# EAGLE schematic NitroxAnalyzer_v2 (EAGLE 7.3.0)
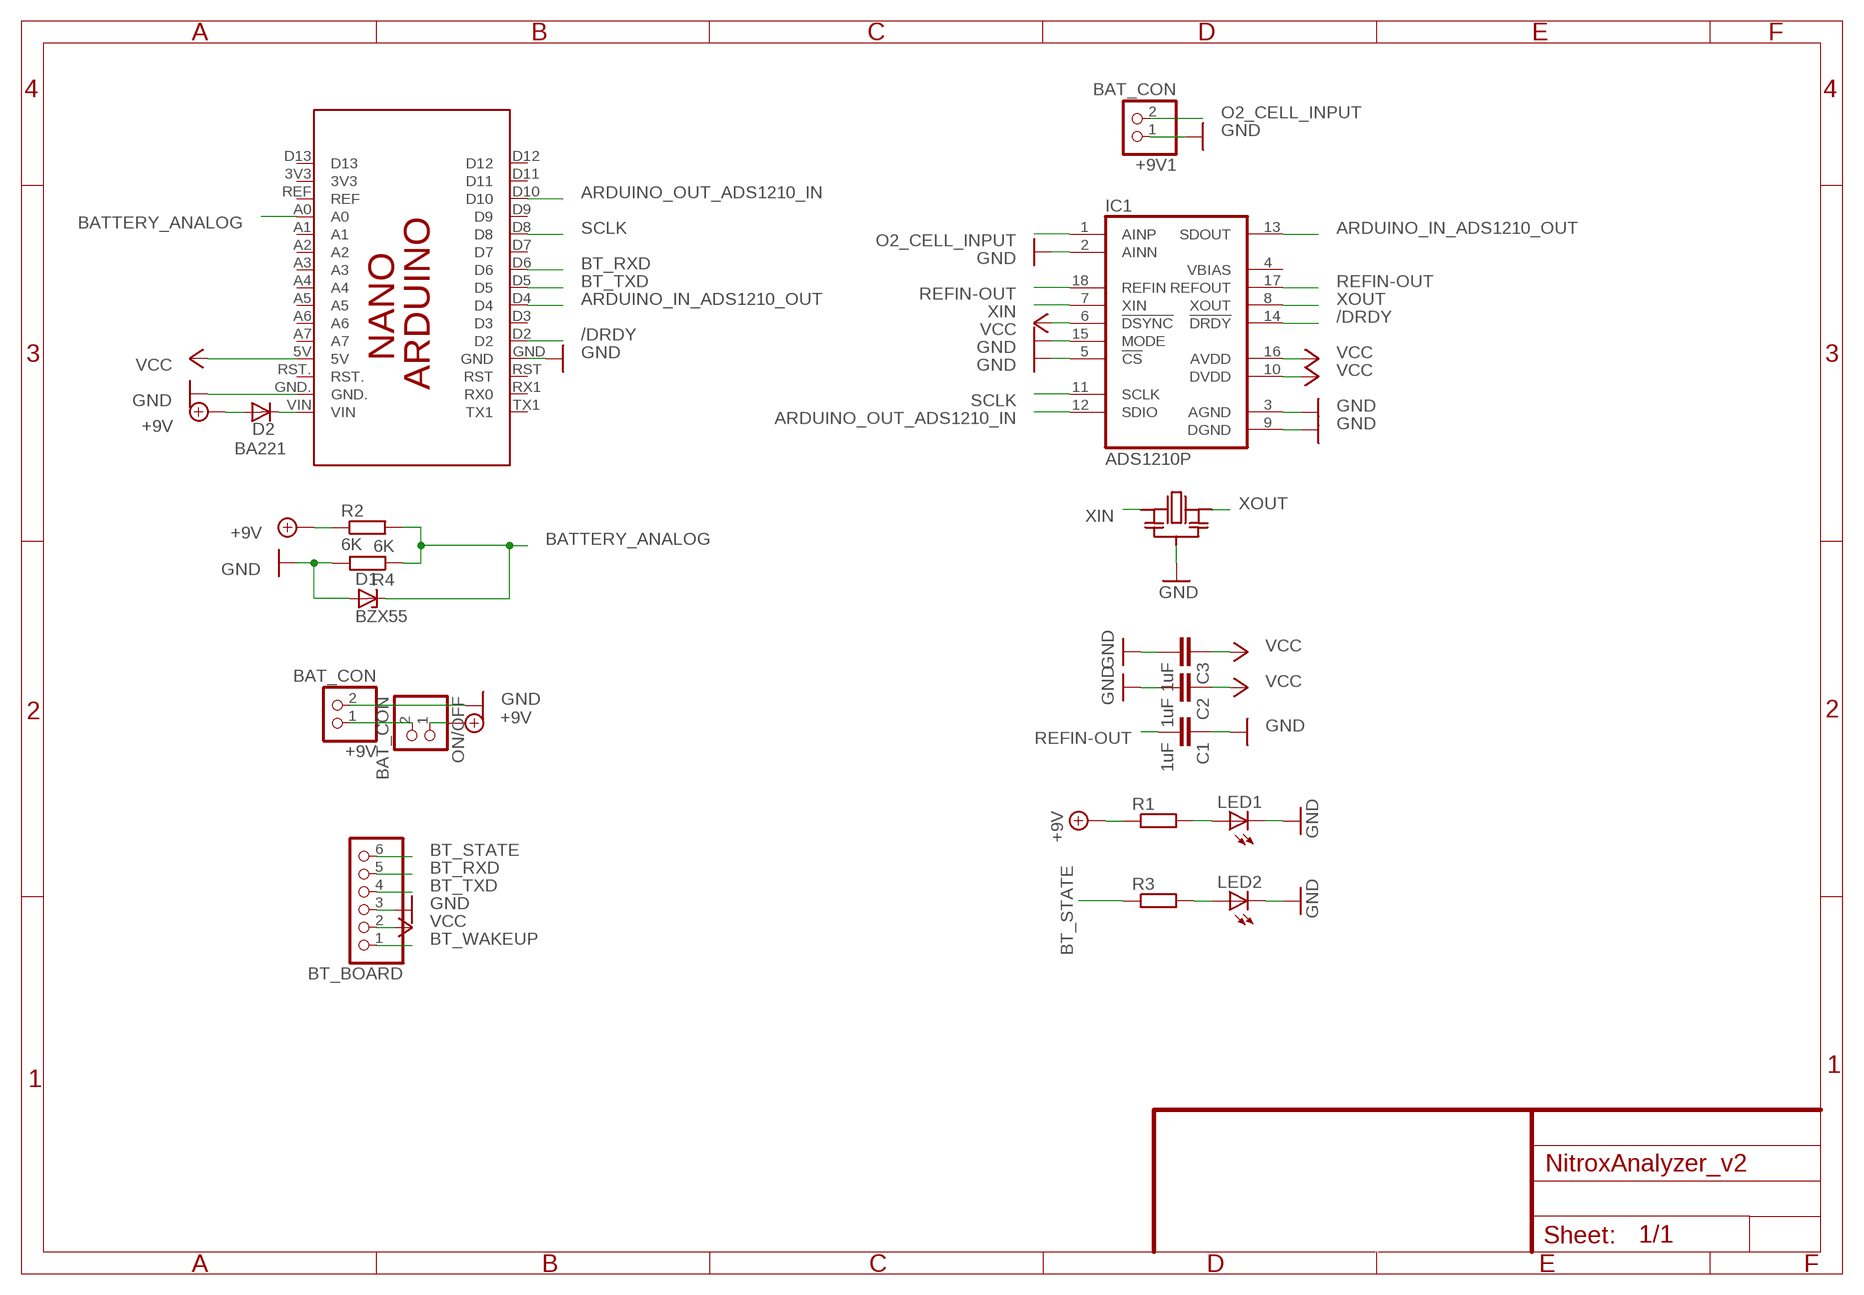
[diagram p0: schematic, sheet 1]

## Parts
+9V  BAT_CON  PINHD-1X2  [1X02]
+9V1  BAT_CON  PINHD-1X2  [1X02]
BT_BOARD  PINHD-1X6  [1X06]
C1  1uF  C-EUC1206  [C1206]
C2  1uF  C-EUC1206  [C1206]
C3  1uF  C-EUC1206  [C1206]
D1  BZX55  [DO35Z10]
D2  BA221  [DO35-10]
IC1  ADS1210P  [DIL18]
LED1  LED3MM  [LED3MM]
LED2  LED3MM  [LED3MM]
ON/OFF  BAT_CON  PINHD-1X2  [1X02]
PCB1  ARDUINO_NANO_SOCKET  [ARDUINO_NANO_SOCKET]
R1  R-EU_R1206  [R1206]
R2  6K  R-EU_R1206  [R1206]
R3  R-EU_R1206  [R1206]
R4  6K  R-EU_R1206  [R1206]
U$2  RESONATOR  [RESONATOR]

## Nets
+9V: D2.A ON/OFF.1 R1.1 R2.1
/DRDY: IC1.14(!DRDY) PCB1.D2
ARDUINO_IN_ADS1210_OUT: IC1.13(SDOUT) PCB1.D4
ARDUINO_OUT_ADS1210_IN: IC1.12(SDIO) PCB1.D10
BATTERY_ANALOG: D1.C PCB1.A0 R2.2 R4.1
BT_RXD: BT_BOARD.5 PCB1.D6
BT_STATE: BT_BOARD.6 R3.1
BT_TXD: BT_BOARD.4 PCB1.D5
BT_WAKEUP: BT_BOARD.1
GND: +9V1.1 +9V.2 BT_BOARD.3 C1.1 C2.2 C3.2 D1.A IC1.2(AINN) IC1.3(AGND) IC1.5(!CS) IC1.9(DGND) IC1.15(MODE) LED1.K(C) LED2.K(C) PCB1.GND PCB1.GND. R4.2 U$2.P$2(GND)
N$1: D2.C PCB1.VIN
N$2: LED1.A R1.2
N$3: LED2.A R3.2
N$5: +9V.1 ON/OFF.2
O2_CELL_INPUT: +9V1.2 IC1.1(AINP)
REFIN-OUT: C1.2 IC1.17(REFOUT) IC1.18(REFIN)
SCLK: IC1.11(SCLK) PCB1.D8
VCC: BT_BOARD.2 C2.1 C3.1 IC1.6(!DSYNC) IC1.10(DVDD) IC1.16(AVDD) PCB1.5V
XIN: IC1.7(XIN) U$2.P$1(IN)
XOUT: IC1.8(XOUT) U$2.P$3(OUT)
Unconnected: IC1.4(VBIAS) PCB1.3V3 PCB1.A1 PCB1.A2 PCB1.A3 PCB1.A4 PCB1.A5 PCB1.A6 PCB1.A7 PCB1.D3 PCB1.D7 PCB1.D9 PCB1.D11 PCB1.D12 PCB1.D13 PCB1.REF PCB1.RST PCB1.RST. PCB1.RX1(RX0) PCB1.TX1

## Library data of the parts
+9V +9V1 ON/OFF = pinhead:PINHD-1X2: PIN HEADER
BT_BOARD = pinhead:PINHD-1X6: PIN HEADER
C1-C3 = rcl:C-EU: CAPACITOR, European symbol
D1 = diode:BZX55: Z DIODE
D2 = diode:BA221: DIODE high speed (Philips)
IC1 = burr-brown:ADS1210: 24-Bit Analog-to-Digital Converter
LED1 LED2 = led:LED: LED OSRAM: - CHIPLED LG R971, LG N971, LY N971, LG Q971, LY Q971, LO R971, LY R971 LH N974, LH R974 LS Q976, LO Q976, LY Q976 LO Q996 - Hyper CHIPLED LW Q18S LB Q993, LB Q99A, LB R99A - SideLED LS A670, LO A670, LY A670, LG A670, LP A670 LB A673, LV A673, LT A673, LW A673 LH A674 LY A675 LS A676, LA A676, LO A676, LY A676, LW A676 LS A679, LY A679, LG A679 - Hyper Micro SIDELED® LS Y876, LA Y876, LO Y876, LY Y876 LT Y87S - SmartLED LW L88C, LW L88S LB L89C, LB L89S, LG L890 LS L89K, LO L89K, LY L89K LS L896, LA L896, LO L896, LY L896 - TOPLED LS T670, LO T670, LY T670, LG T670, LP T670 LSG T670, LSP T670, LSY T670, LOP T670, LYG T670 LG T671, LOG T671, LSG T671 LB T673, LV T673, LT T673, LW T673 LH T674 LS T676, LA T676, LO T676, LY T676, LB T676, LH T676, LSB T676, LW T676 LB T67C, LV T67C, LT T67C, LS T67K, LO T67K, LY T67K, LW E67C LS E67B, LA E67B, LO E67B, LY E67B, LB E67C, LV E67C, LT E67C LW T67C LS T679, LY T679, LG T679 LS T770, LO T770, LY T770, LG T770, LP T770 LB T773, LV T773, LT T773, LW T773 LH T774 LS E675, LA E675, LY E675, LS T675 LS T776, LA T776, LO T776, LY T776, LB T776 LHGB T686 LT T68C, LB T68C - Hyper Mini TOPLED® LB M676 - Mini TOPLED Santana® LG M470 LS M47K, LO M47K, LY M47K Source: http://www.osram.convergy.de/
PCB1 = arduino-sockets:ARDUINO_NANO_SOCKET: Device for representing an Arduino Nano board with a footprint in an EAGLE design. Created by Dave Young for Element14. More EAGLE documentation at: http://www.element14.com/community/community/knode/cadsoft_eagle
R1-R4 = rcl:R-EU_: RESISTOR, European symbol
U$2 = resonator:RESONATOR